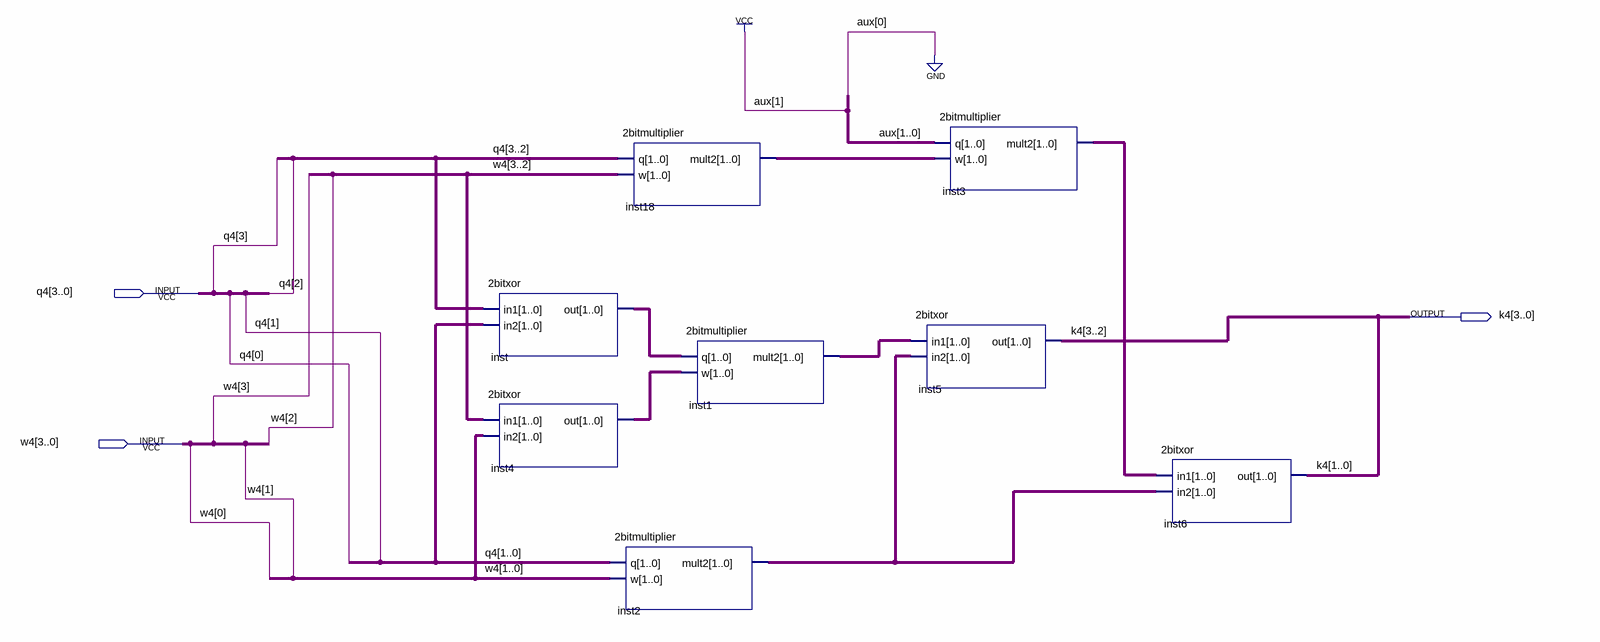
[diagram p0: schematic sheet]
// Quartus schematic 4bitmultiplier.bdf as structural Verilog: 8 symbols, 3 pins
module \4bitmultiplier  (
  input  [3:0] q4,
  input  [3:0] w4,
  output [3:0] k4
);

  wire [1:0] inst1_mult2, inst2_mult2, inst3_mult2, inst4_out, inst18_mult2, inst_out;

  \2bitxor  inst (.in1(q4[3:2]), .in2(q4[1:0]), .out(inst_out));
  \2bitxor  inst4 (.in1(w4[3:2]), .in2(w4[1:0]), .out(inst4_out));
  \2bitmultiplier  inst18 (.q(q4[3:2]), .w(w4[3:2]), .mult2(inst18_mult2));
  \2bitmultiplier  inst2 (.q(q4[1:0]), .w(w4[1:0]), .mult2(inst2_mult2));
  \2bitmultiplier  inst1 (.q(inst_out), .w(inst4_out), .mult2(inst1_mult2));
  \2bitxor  inst5 (.in1(inst1_mult2), .in2(inst2_mult2), .out(k4[3:2]));
  \2bitmultiplier  inst3 (.q(2'b10), .w(inst18_mult2), .mult2(inst3_mult2));
  \2bitxor  inst6 (.in1(inst3_mult2), .in2(inst2_mult2), .out(k4[1:0]));
endmodule
